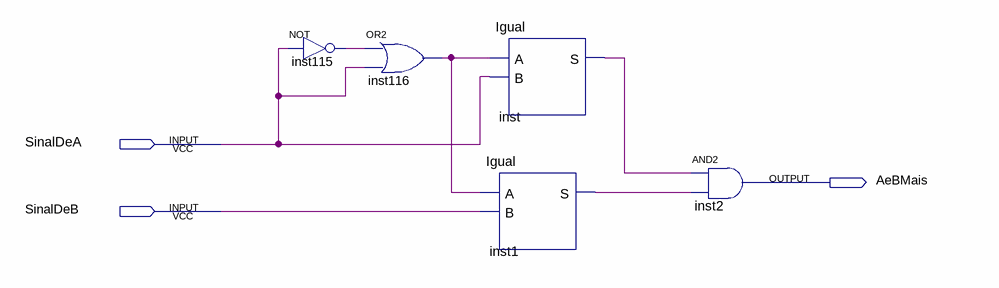
[diagram p0: schematic sheet]
// Quartus schematic AeBMais.bdf as structural Verilog: 5 symbols, 3 pins
module AeBMais (
  input  SinalDeA,
  input  SinalDeB,
  output AeBMais
);

  wire inst1_s, inst115_out, inst116_out, inst_s;

  not inst115 (inst115_out, SinalDeA);
  or inst116 (inst116_out, inst115_out, SinalDeA);
  Igual inst (.A(inst116_out), .B(SinalDeA), .S(inst_s));
  Igual inst1 (.A(inst116_out), .B(SinalDeB), .S(inst1_s));
  and inst2 (AeBMais, inst_s, inst1_s);
endmodule
